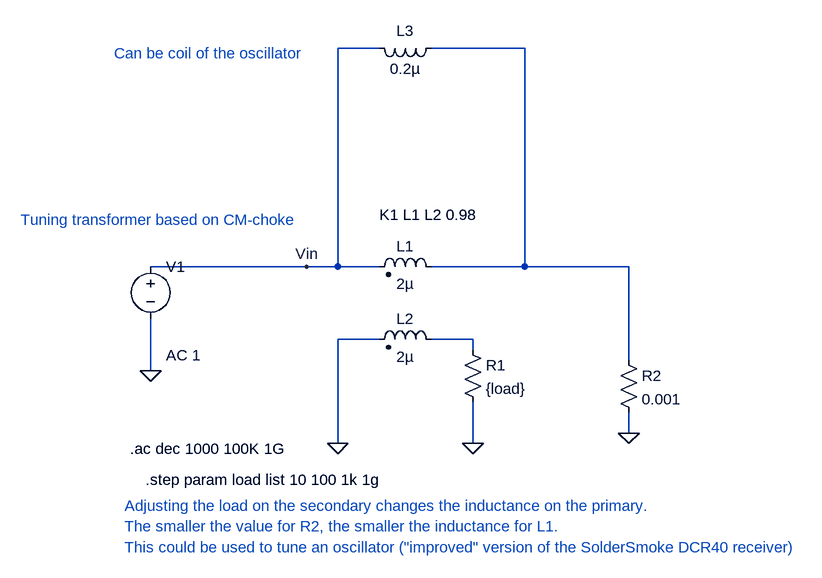
[diagram p0: schematic second_winding.asc]
second_winding.asc, the LTspice schematic file:
Version 4
SHEET 1 880 680
WIRE -96 -336 -160 -336
WIRE 128 -336 -16 -336
WIRE -208 0 -448 0
WIRE -160 0 -160 -336
WIRE -160 0 -208 0
WIRE -96 0 -160 0
WIRE 128 0 128 -336
WIRE 128 0 -16 0
WIRE 288 0 128 0
WIRE -96 112 -160 112
WIRE 48 112 -16 112
WIRE 48 128 48 112
WIRE 288 144 288 0
WIRE -448 160 -448 80
WIRE 288 256 288 224
WIRE -160 272 -160 112
WIRE 48 272 48 208
FLAG -448 160 0
FLAG 288 256 0
FLAG 48 272 0
FLAG -160 272 0
FLAG -208 0 Vin
SYMBOL ind2 0 16 M270
WINDOW 0 32 56 VTop 2
WINDOW 3 5 56 VBottom 2
SYMATTR InstName L1
SYMATTR Value 2µ
SYMATTR Type ind
SYMATTR SpiceLine Rser=0.215
SYMBOL ind2 0 128 M270
WINDOW 0 32 56 VTop 2
WINDOW 3 5 56 VBottom 2
SYMATTR InstName L2
SYMATTR Value 2µ
SYMATTR Type ind
SYMATTR SpiceLine Rser=0.215
SYMBOL voltage -448 -16 R0
WINDOW 123 24 152 Left 2
WINDOW 39 24 124 Left 2
SYMATTR Value2 AC 1
SYMATTR InstName V1
SYMATTR Value ""
SYMBOL res 32 112 R0
SYMATTR InstName R1
SYMATTR Value {load}
SYMBOL res 272 128 R0
SYMATTR InstName R2
SYMATTR Value 0.001
SYMBOL ind 0 -352 R90
WINDOW 0 5 56 VBottom 2
WINDOW 3 32 56 VTop 2
SYMATTR InstName L3
SYMATTR Value 0.2µ
TEXT -96 -80 Left 2 !K1 L1 L2 0.98
TEXT -480 280 Left 2 !.ac dec 1000 100K 1G
TEXT -456 328 Left 2 !.step param load list 10 100 1k 1g
TEXT -488 368 Left 2 ;Adjusting the load on the secondary changes the inductance on the primary.\nThe smaller the value for R2, the smaller the inductance for L1.
TEXT -488 432 Left 2 ;This could be used to tune an oscillator ("improved" version of the SolderSmoke DCR40 receiver)
TEXT -504 -328 Left 2 ;Can be coil of the oscillator
TEXT -648 -72 Left 2 ;Tuning transformer based on CM-choke

The netlist it stands for:
* second_winding.asc
L1 N001 Vin 2µ Rser=0.215
L2 N002 0 2µ Rser=0.215
V1 Vin 0 AC 1
R1 N002 0 {load}
R2 N001 0 0.001
L3 N001 Vin 0.2µ
K1 L1 L2 0.98
.ac dec 1000 100K 1G
.step param load list 10 100 1k 1g
* Adjusting the load on the secondary changes the inductance on the primary.
* The smaller the value for R2, the smaller the inductance for L1.
* This could be used to tune an oscillator ("improved" version of the SolderSmoke DCR40 receiver)
* Can be coil of the oscillator
* Tuning transformer based on CM-choke
.backanno
.end